# Altium schematic sheet Skey.SchDoc
size 76 x 63 mm
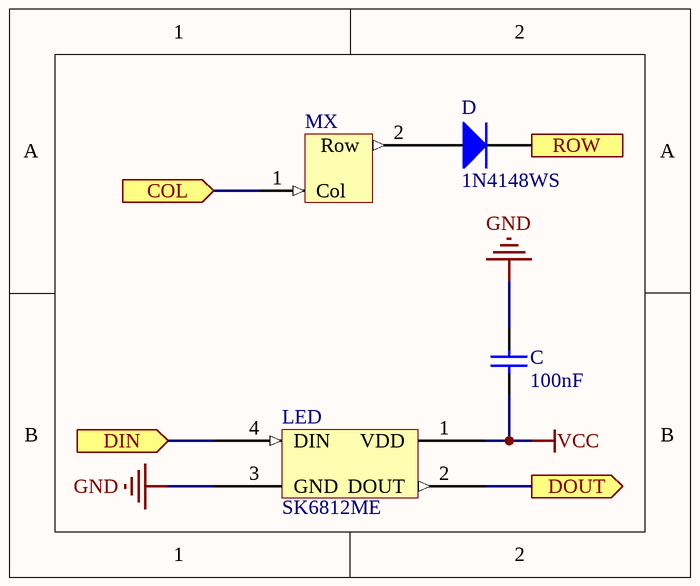
[diagram p0: Skey.SchDoc]

## Parts
C  100nF  [CAPC1005X55X30LL05T10]
D  1N4148WS  [DIOD-SOD323-2-A_V]
LED  SK6812ME  [SK6812ME]
MX  (no value)  [MX]

## Ports
COL (in), DIN (in), DOUT (out), ROW (out)

## Nets
GND: C.2 LED.3(GND)
VCC: C.1 LED.1(VDD)
COL: MX.1(Col) ; port COL
DIN: LED.4(DIN) ; port DIN
DOUT: LED.2(DOUT) ; port DOUT
ROW: D.2(K) ; port ROW
NetD_1: D.1(A) MX.2(Row)

## Library data of the parts
C = CMP-0001-00074-2: Manufacturer: Kemet; Part Number: C0402C104K4RACTU
D = CMP-1667-00004-1: Fast Switching Diode, 75 V, 0.3 A, -65 to 150 degC, 2-Pin SOD323, RoHS, Tape and Reel; DatasheetVersion: Rev. 25-2, 03/2016; PackageDescription: 2-Pin Small Outline Diode, Body 1.7 x 1.3 mm; ComponentLink2Description: Datasheet; ComponentLink1URL: http://www.diodes.com/; PackageReference: SOD323-2; ComponentLink2URL: http://www.diodes.com/datasheets/ds30097.pdf; ComponentLink1Description: Manufacturer URL
LED = SK6812: Individually Adressable SK6812 Mini-E 3528 LED
MX = MX: Cherry MX Footprint